# Altium schematic sheet Amplifier.SchDoc
size 381 x 241 mm
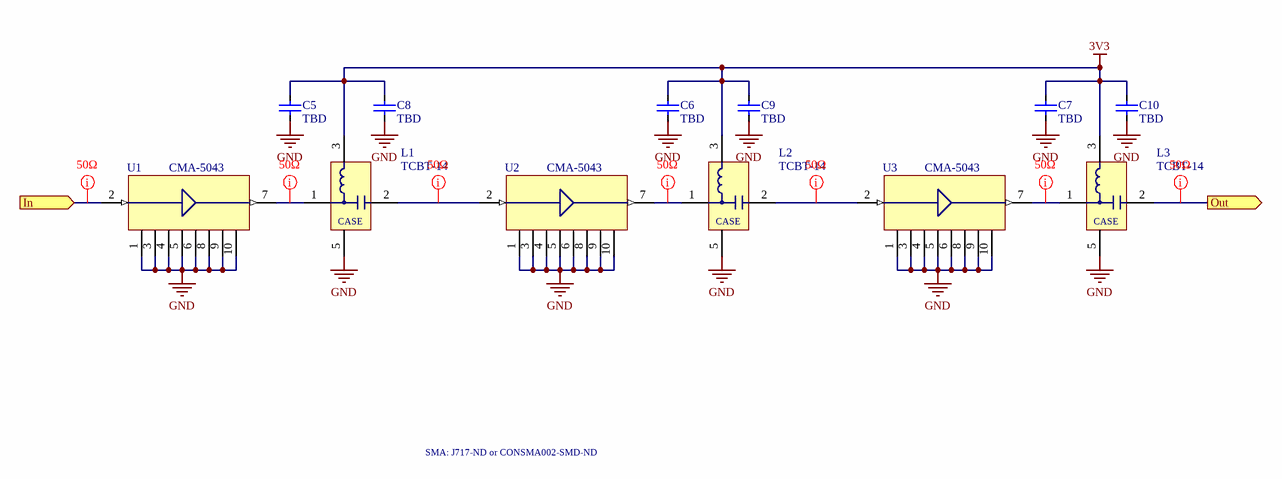
[diagram p0: Amplifier.SchDoc]

## Parts
C5  value TBD  [0805C]  (hidden comment: Cap)
C6  value TBD  [0805C]  (hidden comment: Cap)
C7  value TBD  [0805C]  (hidden comment: Cap)
C8  value TBD  [0805C]  (hidden comment: Cap)
C9  value TBD  [0805C]  (hidden comment: Cap)
C10  value TBD  [0805C]  (hidden comment: Cap)
L1  TCBT-14  [GU1414]
L2  TCBT-14  [GU1414]
L3  TCBT-14  [GU1414]
U1  CMA-5043  [DL1721]
U2  CMA-5043  [DL1721]
U3  CMA-5043  [DL1721]

## Ports
In (in), Out (out)

## Nets
3V3: C5.2 C6.2 C7.2 C8.2 C9.2 C10.2 L1.3(DC) L2.3(DC) L3.3(DC)
GND: C5.1 C6.1 C7.1 C8.1 C9.1 C10.1 L1.5(CASE) L2.5(CASE) L3.5(CASE) U1.1(Gnd) U1.3(Gnd) U1.4(Gnd) U1.5(Gnd) U1.6(Gnd) U1.8(Gnd) U1.9(Gnd) U1.10(Gnd) U2.1(Gnd) U2.3(Gnd) U2.4(Gnd) U2.5(Gnd) U2.6(Gnd) U2.8(Gnd) U2.9(Gnd) U2.10(Gnd) U3.1(Gnd) U3.3(Gnd) U3.4(Gnd) U3.5(Gnd) U3.6(Gnd) U3.8(Gnd) U3.9(Gnd) U3.10(Gnd)
In: U1.2(In) ; port In
Out: L3.2(RF) ; port Out
NetL1_1: L1.1(RF+DC) U1.7(Gnd)
NetL1_2: L1.2(RF) U2.2(In)
NetL2_1: L2.1(RF+DC) U2.7(Gnd)
NetL2_2: L2.2(RF) U3.2(In)
NetL3_1: L3.1(RF+DC) U3.7(Gnd)

Not connected (* = marked no-connect by the designer): L1 4(NC); L2 4(NC); L3 4(NC)

## Layout directives
rule Width Constraint [Pref Impedance = 50.00ohms    Min Impedance = 45.00ohms    Max Impedance = 70.00ohms]: In, NetL1_1, NetL1_2, NetL2_1, NetL2_2, NetL3_1, Out

## Notes on the sheet
- SMA: J717-ND or CONSMA002-SMD-ND

## Library data of the parts
C5-C10 = Cap: Capacitor; Published: 8-Jun-2000; LatestRevisionDate: 17-Jul-2002; LatestRevisionNote: Re-released for DXP Platform.; PackageReference: RAD-0.3; Publisher: Altium Limited
L1-L3 = TCBT-14: Surface Mount 10 MHz to 10 GHz Bias Tee
U1-U3 = CMA-5043: Low Noise, High IP3 Monolithic Amplifier